# Altium schematic sheet DisplayIface.SchDoc
size A; SheetNumber: 3; SheetTotal: 9
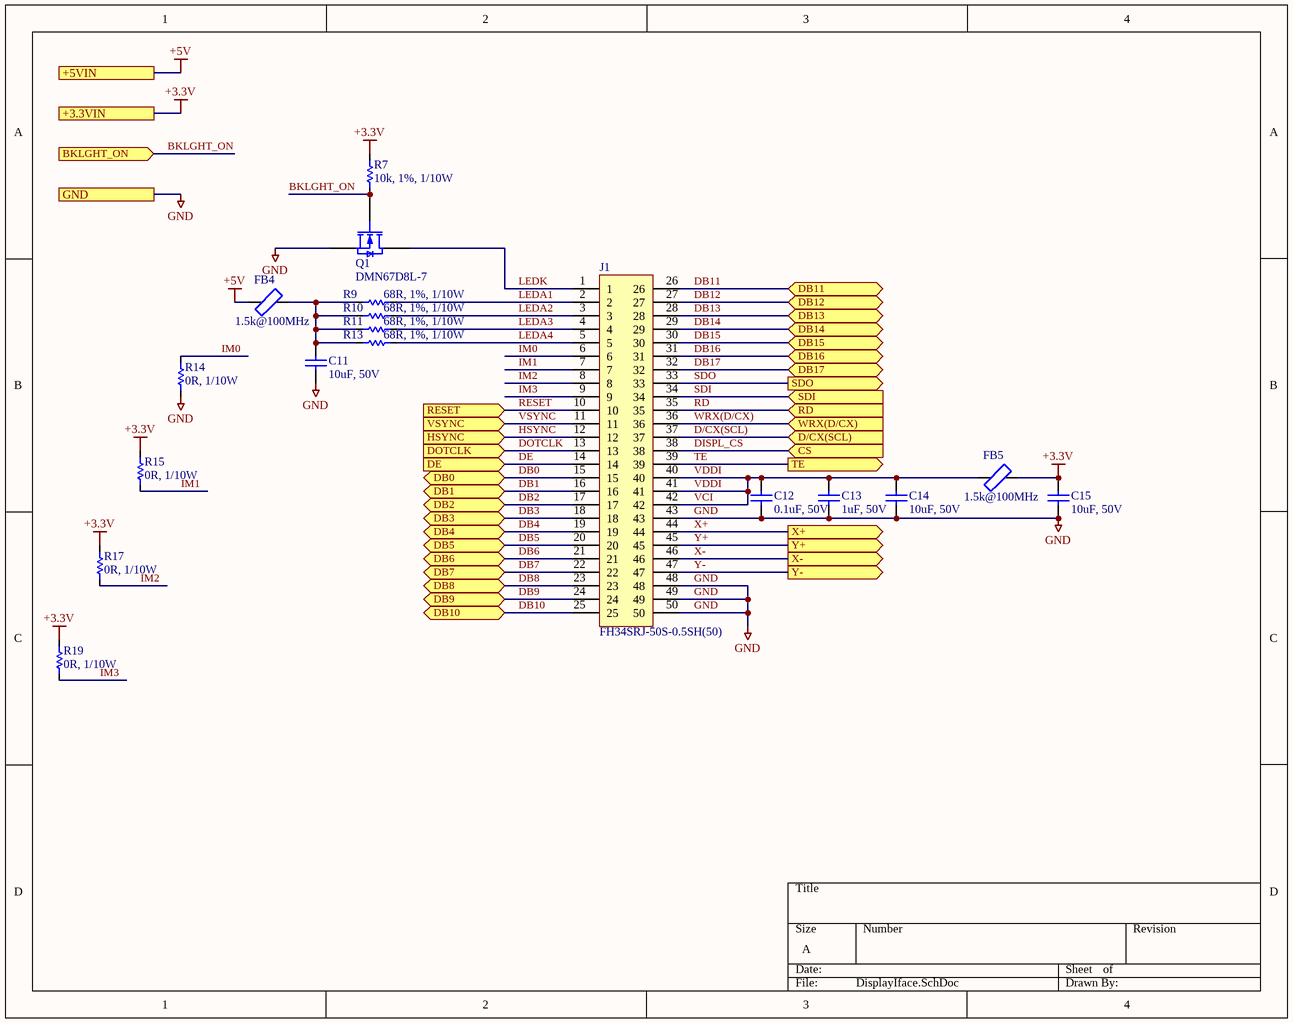
[diagram p0: DisplayIface.SchDoc]

## Parts
C11  10uF, 50V  [1206]
C12  0.1uF, 50V  [0805]
C13  1uF, 50V  [0805]
C14  10uF, 50V  [1206]
C15  10uF, 50V  [1206]
FB4  1.5k@100MHz  [0805]
FB5  1.5k@100MHz  [0805]
J1  FH34SRJ-50S-0.5SH(50)  [CONN_HIROSE_FH34SRJ-50S-0.5SH(50)]
Q1  DMN67D8L-7  [SOT23-3]
R7  10k, 1%, 1/10W  [0603]
R9  68R, 1%, 1/10W  [0603]
R10  68R, 1%, 1/10W  [0603]
R11  68R, 1%, 1/10W  [0603]
R13  68R, 1%, 1/10W  [0603]
R14  0R, 1/10W  [0603]
R15  0R, 1/10W  [0603]
R17  0R, 1/10W  [0603]
R19  0R, 1/10W  [0603]

## Ports
+3.3VIN, +5VIN, BKLGHT_ON (in), CS (in), D/CX(SCL) (in), DB0 (bidir), DB1 (bidir), DB2 (bidir), DB3 (bidir), DB4 (bidir), DB5 (bidir), DB6 (bidir), DB7 (bidir), DB8 (bidir), DB9 (bidir), DB10 (bidir), DB11 (bidir), DB12 (bidir), DB13 (bidir), DB14 (bidir), DB15 (bidir), DB16 (bidir), DB17 (bidir), DE (in), DOTCLK (in), GND, HSYNC (in), RD (in), RESET (in), SDI (in), SDO (out), TE (out), VSYNC (in), WRX(D/CX) (in), X+ (out), X- (out), Y+ (out), Y- (out)

## Nets
+3.3V: C15.2 FB5.1 R7.2 R15.2 R17.2 R19.2 ; port +3.3VIN
+5V: FB4.2 ; port +5VIN
GND: C11.1 C12.1 C13.1 C14.1 C15.1 J1.43 J1.48 J1.49 J1.50 Q1.2(S) R14.1 ; port GND
BKLGHT_ON: Q1.1(G) R7.1 ; port BKLGHT_ON
D/CX(SCL): J1.37 ; port D/CX(SCL)
DB0: J1.15 ; port DB0
DB1: J1.16 ; port DB1
DB2: J1.17 ; port DB2
DB3: J1.18 ; port DB3
DB4: J1.19 ; port DB4
DB5: J1.20 ; port DB5
DB6: J1.21 ; port DB6
DB7: J1.22 ; port DB7
DB8: J1.23 ; port DB8
DB9: J1.24 ; port DB9
DB10: J1.25 ; port DB10
DB11: J1.26 ; port DB11
DB12: J1.27 ; port DB12
DB13: J1.28 ; port DB13
DB14: J1.29 ; port DB14
DB15: J1.30 ; port DB15
DB16: J1.31 ; port DB16
DB17: J1.32 ; port DB17
DE: J1.14 ; port DE
DISPL_CS: J1.38 ; port CS
DOTCLK: J1.13 ; port DOTCLK
HSYNC: J1.12 ; port HSYNC
IM0: J1.6 R14.2
IM1: J1.7 R15.1
IM2: J1.8 R17.1
IM3: J1.9 R19.1
LEDA1: J1.2 R9.2
LEDA2: J1.3 R10.2
LEDA3: J1.4 R11.2
LEDA4: J1.5 R13.2
LEDK: J1.1 Q1.3(D)
RD: J1.35 ; port RD
RESET: J1.10 ; port RESET
SDI: J1.34 ; port SDI
SDO: J1.33 ; port SDO
TE: J1.39 ; port TE
VCI: C12.2 C13.2 C14.2 FB5.2 J1.40 J1.41 J1.42  [also labelled VDDI]
VSYNC: J1.11 ; port VSYNC
WRX(D/CX): J1.36 ; port WRX(D/CX)
X+: J1.44 ; port X+
X-: J1.46 ; port X-
Y+: J1.45 ; port Y+
Y-: J1.47 ; port Y-
NetC11_2: C11.2 FB4.1 R9.1 R10.1 R11.1 R13.1

## Library data of the parts
C11 C14 C15 = NS00832: CAP CER 10UF 50V X7R 1206; Type: C; Alternatives: Generic; Part Number: NS00832; Value: 10uF, 50V; Supplier 1: Digi-Key; Supplier Part Number 1: 1276-6767-1-ND
C12 = NS00353: 0.10µF ±10% 50V Ceramic Capacitor X7R 0805 (2012 Metric); Type: C; Alternatives: Generic; Part Number: NS00353; Value: 0.1uF, 50V; Supplier 1: Digi-Key; Supplier Part Number 1: 478-1395-1-ND
C13 = NS00871: CAP CER 1UF 50V X7R 0805; Type: C; Alternatives: Generic; Part Number: NS00871; Value: 1uF, 50V; Supplier 1: Digi-Key; Supplier Part Number 1: 1276-6470-1-ND
FB4 FB5 = NS00881: WE-CBA SMT EMI SUPPRESSION FERRITE; Type: Inductor; Part Number: NS00881; Value: 1.5k@100MHz; ComponentLink1Description: Datasheet; ComponentLink1URL: H:\Doc\Wurth\782853162.pdf; Supplier 1: Digi-Key; Supplier Part Number 1: 732-782853162CT-ND
J1 = NS00813: CONN FFC 50 WAY; Part Number: NS00813; Type: Connector; Value: FH34SRJ-50S-0.5SH(50); ComponentLink1Description: Datasheet; ComponentLink1URL: H:\Doc\Hirose\FH34SRJ-50S-0.5SH(50)_CL0580-1266-2-50_SpecSheet_0000414509.pdf; ComponentLink2Description: Drawing; ComponentLink2URL: H:\Doc\Hirose\FH34SRJ-50S-0.5SH(50)_CL0580-1266-2-50_2DDrawing_0001483059.pdf; Supplier 1: Digi-Key; Supplier Part Number 1: FH34SRJ-50S-0.5SH(50)
Q1 = NS00873: MOSFET N-CH 60V 210MA SOT23; Type: IC; Published: 8-Jun-2000; LatestRevisionDate: 17-Jul-2002; LatestRevisionNote: Re-released for DXP Platform.; PackageVersion: 1995/1996; PackageReference: E3; Publisher: Altium Limited; Part Number: NS00873; Value: DMN67D8L-7; ComponentLink1Description: Datasheet; ComponentLink1URL: H:\Doc\Diodes\DMN67D8L.pdf; Supplier 1: Digi-Key; Supplier Part Number 1: DMN67D8L-7DICT-ND
R7 = NS00820: RES 10K OHM 1% 1/10W 0603; Alternatives: Generic; Part Number: NS00820; Type: R; Value: 10k, 1%, 1/10W; Supplier 1: Digi-Key; Supplier Part Number 1: RMCF0603FT10K0CT-ND
R9-R11 R13 = NS00814: RES 68 OHM 1% 1/10W 0603; Alternatives: Generic; Part Number: NS00814; Type: R; Value: 68R, 1%, 1/10W; Supplier 1: Digi-Key; Supplier Part Number 1: 1292-WR06X68R0FTLCT-ND
R14 R15 R17 R19 = NS00876: RES 0 OHM JUMPER 1/10W 0603; Alternatives: Generic; Part Number: NS00876; Type: R; Value: 0R, 1/10W; Supplier 1: Digi-Key; Supplier Part Number 1: RMCF0603ZT0R00CT-ND